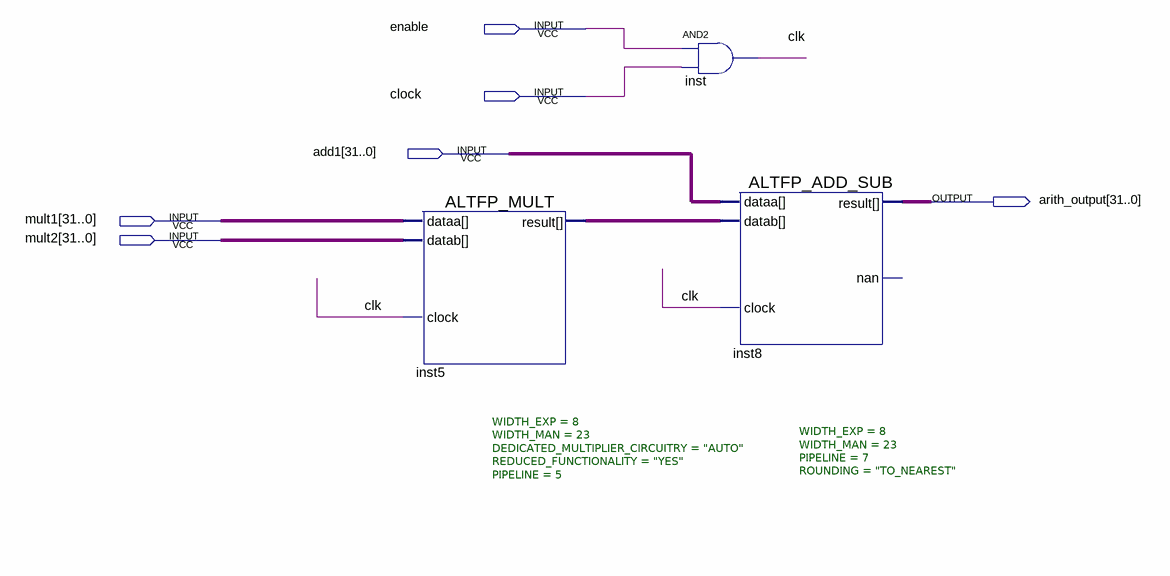
[diagram p0: schematic sheet]
// Quartus schematic ALU.bdf as structural Verilog: 3 symbols, 6 pins
module ALU (
  input  enable,
  input  clock,
  input  [31:0] add1,
  input  [31:0] mult1,
  input  [31:0] mult2,
  output [31:0] arith_output
);

  wire clk;
  wire [31:0] inst5_result;

  ALTFP_MULT #(.WIDTH_EXP(8), .WIDTH_MAN(23), .DEDICATED_MULTIPLIER_CIRCUITRY("AUTO"), .REDUCED_FUNCTIONALITY("YES"), .PIPELINE(5)) inst5 (
    .clock(clk), .dataa(mult1), .datab(mult2), .result(inst5_result));
  and inst (clk, enable, clock);
  ALTFP_ADD_SUB #(.WIDTH_EXP(8), .WIDTH_MAN(23), .PIPELINE(7), .ROUNDING("TO_NEAREST")) inst8 (
    .clock(clk), .dataa(add1), .datab(inst5_result), .result(arith_output));  // open: nan
endmodule
